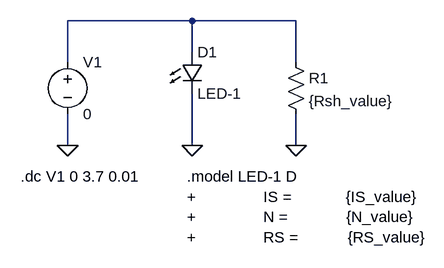
[diagram p0: schematic Voltage_Source_LED_sweep_parametric.asc]
Voltage_Source_LED_sweep_parametric.asc, the LTspice schematic file:
Version 4
SHEET 1 880 680
WIRE 256 64 64 64
WIRE 416 64 256 64
WIRE 256 112 256 64
WIRE 64 128 64 64
WIRE 416 128 416 64
WIRE 64 256 64 208
WIRE 256 256 256 176
WIRE 416 256 416 208
FLAG 64 256 0
FLAG 256 256 0
FLAG 416 256 0
SYMBOL LED 240 112 R0
SYMATTR InstName D1
SYMATTR Value LED-1
SYMBOL voltage 64 112 R0
WINDOW 123 0 0 Left 0
WINDOW 39 0 0 Left 0
SYMATTR InstName V1
SYMATTR Value 0
SYMBOL res 400 112 R0
SYMATTR InstName R1
SYMATTR Value {Rsh_value}
TEXT -8 304 Left 2 !.dc V1 0 3.7 0.01
TEXT 248 304 Left 2 !.model LED-1 D\n+               IS =            {IS_value}\n+               N =             {N_value}\n+               RS =           {RS_value}

The netlist it stands for:
* Voltage_Source_LED_sweep_parametric.asc
D1 N001 0 LED-1
V1 N001 0 0
R1 N001 0 {Rsh_value}
.model D D
.lib standard.dio
.dc V1 0 3.7 0.01
.model LED-1 D
+               IS =            {IS_value}
+               N =             {N_value}
+               RS =           {RS_value}
.backanno
.end